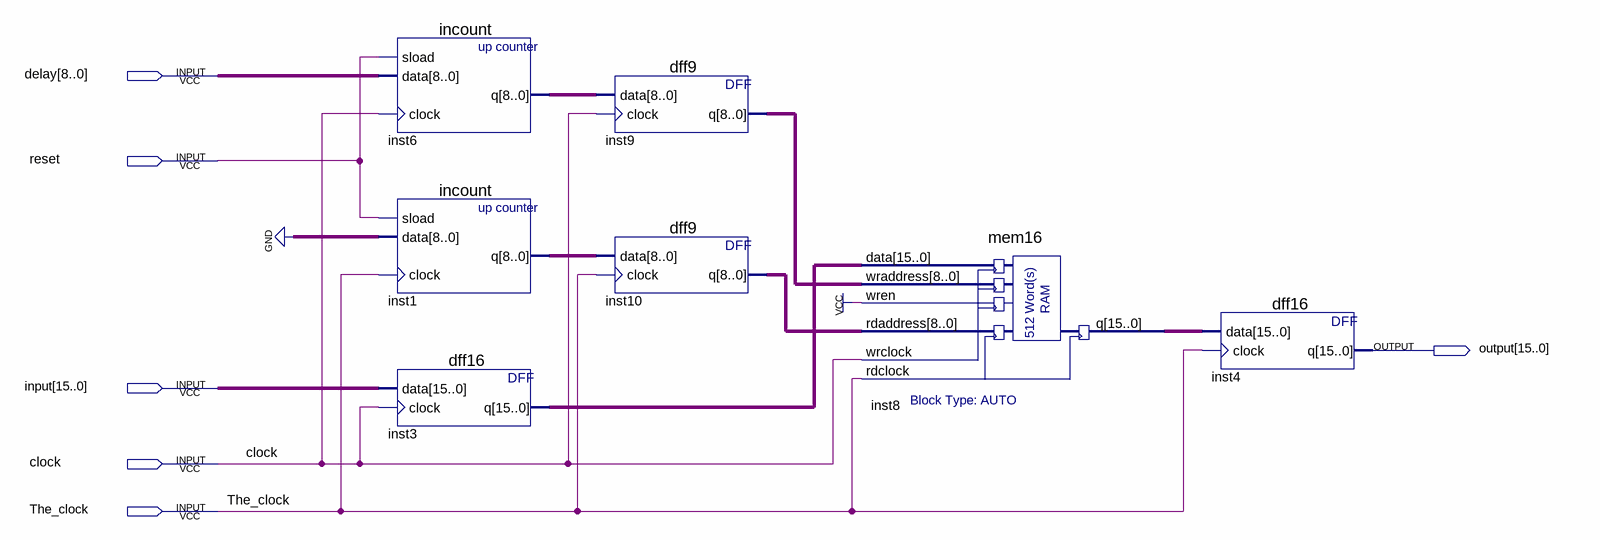
[diagram p0: schematic sheet]
// Quartus schematic GLINK_Buffer.bdf as structural Verilog: 7 symbols, 6 pins
module GLINK_Buffer (
  input  [8:0] delay,
  input  reset,
  input  [15:0] \input ,
  input  clock,
  input  The_clock,
  output [15:0] \output 
);

  wire [8:0] inst1_q, inst6_q, inst9_q, inst10_q;
  wire [15:0] inst3_q, inst8_q;

  incount inst6 (.sload(reset), .data(delay), .clock(clock), .q(inst6_q));
  incount inst1 (.sload(reset), .data({9{1'b0}}), .clock(The_clock), .q(inst1_q));
  dff16 inst3 (.data(\input ), .clock(clock), .q(inst3_q));
  dff9 inst9 (.data(inst6_q), .clock(clock), .q(inst9_q));
  dff9 inst10 (.data(inst1_q), .clock(The_clock), .q(inst10_q));
  mem16 inst8 (
    .data(inst3_q), .wraddress(inst9_q), .wren(1'b1), .rdaddress(inst10_q), .wrclock(clock),
    .rdclock(The_clock), .q(inst8_q));
  dff16 inst4 (.data(inst8_q), .clock(The_clock), .q(\output ));
endmodule
